# Altium schematic sheet NGFF_B.SchDoc
size A4; SheetNumber: 9; SheetTotal: 11
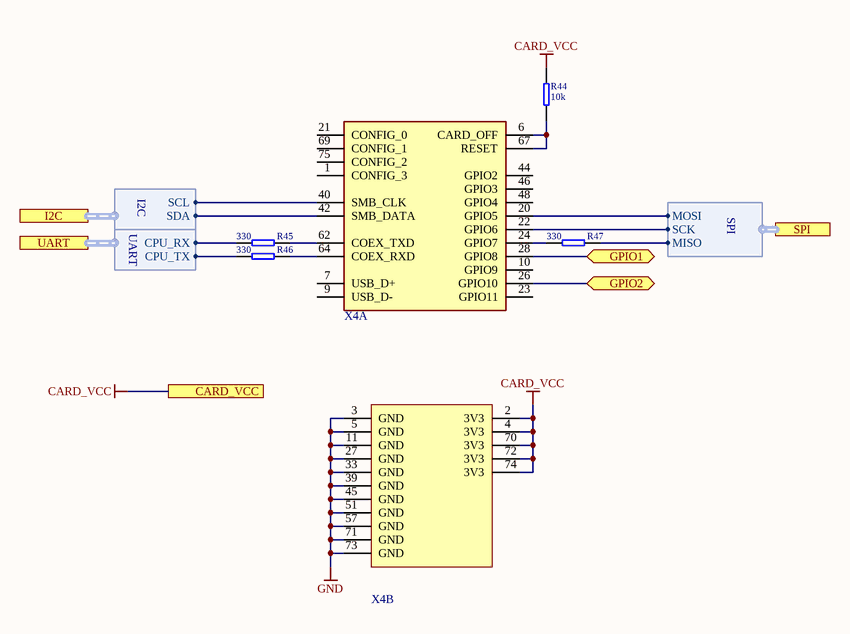
[diagram p0: NGFF_B.SchDoc]

## Parts
R44  value 10k  [RES 0402]
R45  value 330  [RES 0402]
R46  value 330  [RES 0402]
R47  value 330  [RES 0402]
X4  2199230-3  [NGFF_B3_30MM]  (value not drawn)  (parts A,B of 3)

## Ports
CARD_VCC, GPIO1 (bidir), GPIO2 (bidir), I2C (harness I2C), SPI (harness SPI), UART (harness UART)

## Harnesses
UART: CPU_RX, CPU_TX
I2C: SDA, SCL
SPI: MOSI, SCK, MISO

## Nets
CARD_VCC: R44.2 X4.2(3V3) X4.4(3V3) X4.70(3V3) X4.72(3V3) X4.74(3V3) ; port CARD_VCC
GND: X4.3(GND) X4.5(GND) X4.11(GND) X4.27(GND) X4.33(GND) X4.39(GND) X4.45(GND) X4.51(GND) X4.57(GND) X4.71(GND) X4.73(GND)
GPIO1: X4.28(GPIO8) ; port GPIO1
GPIO2: X4.26(GPIO10) ; port GPIO2
NetR44_1: R44.1 X4.6(CARD_OFF) X4.67(RESET)
NetR45_1: R45.1 ; port UART.CPU_RX
NetR45_2: R45.2 X4.62(COEX_TXD)
NetR46_1: R46.1 ; port UART.CPU_TX
NetR46_2: R46.2 X4.64(COEX_RXD)
NetR47_1: R47.1 X4.24(GPIO7)
NetR47_2: R47.2 ; port SPI.MISO
NetX4_20: X4.20(GPIO5) ; port SPI.MOSI
NetX4_22: X4.22(GPIO6) ; port SPI.SCK
NetX4_40: X4.40(SMB_CLK) ; port I2C.SCL
NetX4_42: X4.42(SMB_DATA) ; port I2C.SDA

Not connected (* = marked no-connect by the designer): X4 1(CONFIG_3) 7(USB_D+) 9(USB_D-) 10(GPIO9) 21(CONFIG_0) 23(GPIO11) 44(GPIO2) 46(GPIO3) 48(GPIO4) 69(CONFIG_1) 75(CONFIG_2)

## Library data of the parts
R44-R47 = !Resistor: Resistor; IsSMT: NoSMT
X4 = NGFF_B: M.2 0.5PITCH 4.2H KEY B 15U'' AU